# EAGLE design atsha204-breakout (EAGLE 6.2)
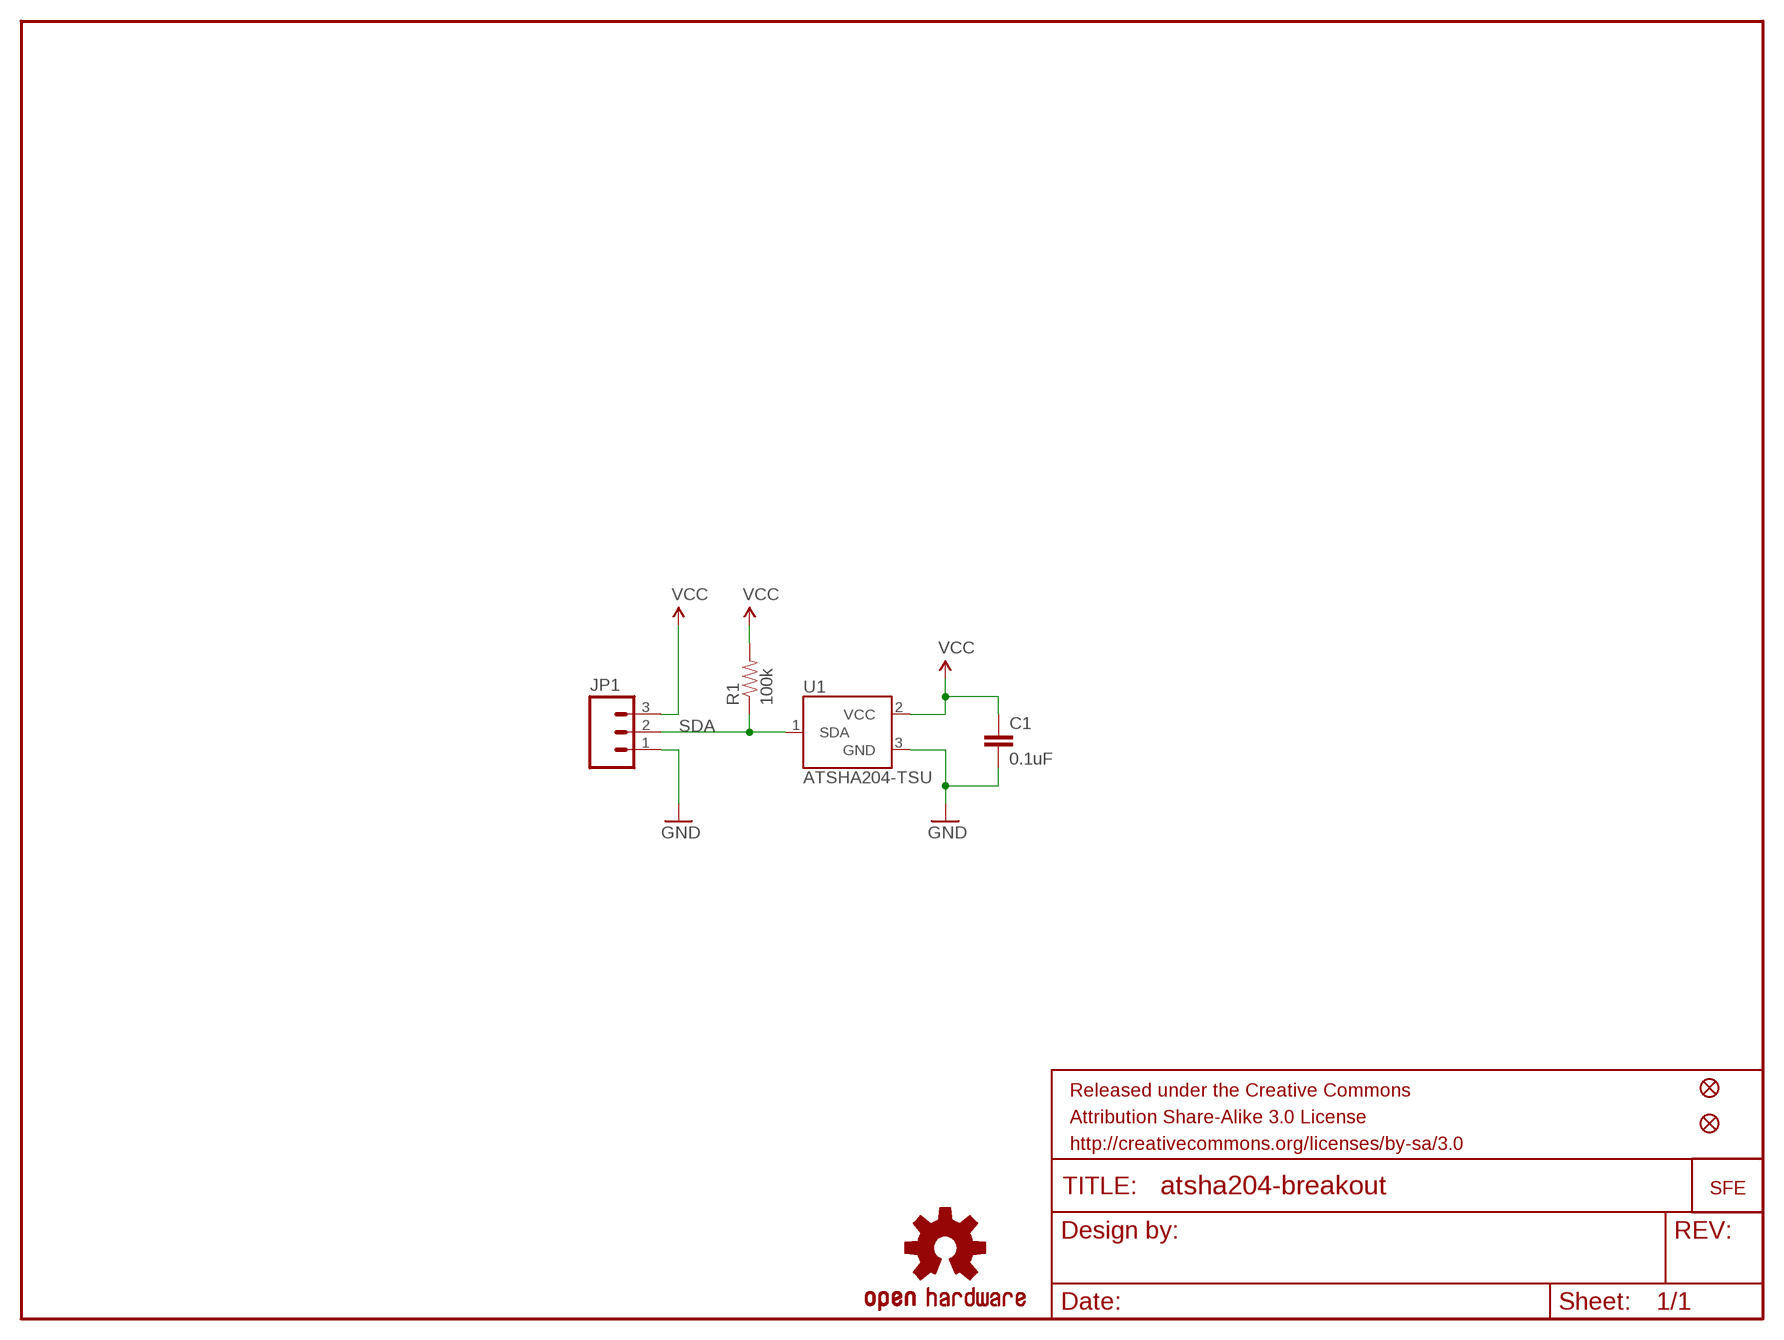
[diagram p0: schematic, sheet 1]

## Parts
C1  0.1uF  CAP0402-CAP  [0402-CAP]
JP1  M031X03_NO_SILK  [1X03_NO_SILK]
JP2  LOGO-SFESK  [SFE-LOGO-FLAME]
JP3  FIDUCIALUFIDUCIAL  [MICRO-FIDUCIAL]
JP4  FIDUCIALUFIDUCIAL  [MICRO-FIDUCIAL]
R1  100k  RESISTOR0402-RES  [0402-RES]
U1  ATSHA204-TSU  [SOT23-3]
U$1  OSHW-LOGOS  [OSHW-LOGO-S]

## Nets
GND: C1.2 JP1.1 U1.3(GND)
SDA: JP1.2 R1.1 U1.1(SDA)
VCC: C1.1 JP1.3 R1.2 U1.2(VCC)

## Library data of the parts
C1 = SparkFun-Passives:CAP: Capacitor Standard 0603 ceramic capacitor, and 0.1" leaded capacitor.
JP1 = SparkFun-Connectors:M03: Header 3 Standard 3-pin 0.1" header. Use with straight break away headers (SKU : PRT-00116), right angle break away headers (PRT-00553), swiss pins (PRT-00743), machine pins (PRT-00117), and female headers (PRT-00115). Molex polarized connector foot print use with SKU : PRT-08232 with associated crimp pins and housings.
JP2 = SparkFun-Aesthetics:LOGO-SFE: Spark Fun Electronics PCB Logo This is the standard Spark Fun Electronics PCB logo.
JP3 JP4 = SparkFun:FIDUCIAL: Fiducial Alignment Points Various fiducial points for machine vision alignment.
R1 = SparkFun-Passives:RESISTOR: Resistor Basic schematic elements and footprints for 0603, 1206, and PTH resistors.
U1 = SparkFun-DigitalIC:ATSHA204
U$1 = SparkFun-Aesthetics:OSHW-LOGO: Open Source Hardware Logo This logo indicates the piece of hardware it is found on incorporates a OSHW license and/or adheres to the definition of open source hardware found here: http://freedomdefined.org/OSHW

## Board
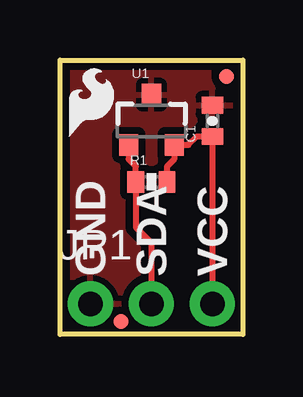
[diagram p1: board, top side]
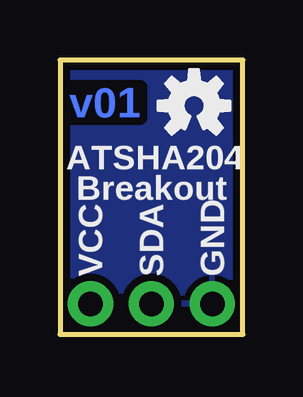
[diagram p2: board, bottom side, seen from below]

Size 7.62 x 11.43 mm. Coordinates in mm from the lower left corner, seen from the top.
Outline: 0,0 0,11.43 7.62,11.43 7.62,0 0,0
Copper layers (1*16): Top 0.035mm / dielectric 1.5mm / Bottom 0.035mm
Design rules: minimum track width 8mil, minimum drill 20mil, track to track 8mil, track to pad 8mil, pad to pad 8mil, via to via 8mil, smd to smd 8mil, copper to edge 8mil, drill to drill 8mil, minimum pad ring 12mil, minimum via ring 10mil, stop-mask expansion 4mil, vias tented up to drill 20mil, thermal gap 10mil

### Footprints (pad centres in the part's own frame; a part is rotated, then mirrored left to right if it is on the bottom)
0402-CAP = smd 0.7 x 0.9: 1 -0.65,0; 2 0.65,0
1X03_NO_SILK = drill 1.016 pad 1.88: 1 0,0; 2 2.54,0; 3 5.08,0
MICRO-FIDUCIAL = smd 0.635 x 0.635: 1 0,0
0402-RES = smd 0.7 x 0.9: 1 -0.65,0; 2 0.65,0
SOT23-3 = smd 0.8 x 0.9: 1 -0.95,-1; 2 0.95,-1; 3 0,1.1

### Placement (x,y rotation side)
C1  6.35,8.89 90 top
JP1  1.27,1.27 0 top
JP2  0.38,8.26 0 top
JP3  6.93,10.74 0 top
JP4  2.54,0.53 0 top
R1  3.81,6.35 0 top
U1  3.81,8.89 0 top
U$1  2.03,9.53 0 bottom

### Tracks (layer width: path | path; a pad name or v marks a point on that pad's centre or on a via)
GND
  pour Top (isolate 0.305): 0,11.43 0,0 7.62,0 7.62,11.43
  pour Bottom (isolate 0.305): 0,11.43 0,0 7.62,0 7.62,11.43
SDA
  Top 0.254: U1.1 2.86,7.3 3.16,7 R1.1 3.16,4.46 3.81,3.81 JP1.2
VCC
  Top 0.254: R1.2 4.46,7 4.76,7.3 U1.2 5.35,7.89 5.7,8.24 C1.1 JP1.3

### Text on the board
Bottom: v01
tPlace: GND | SDA | VCC
bPlace: ATSHA204 | Breakout | GND | SDA | VCC